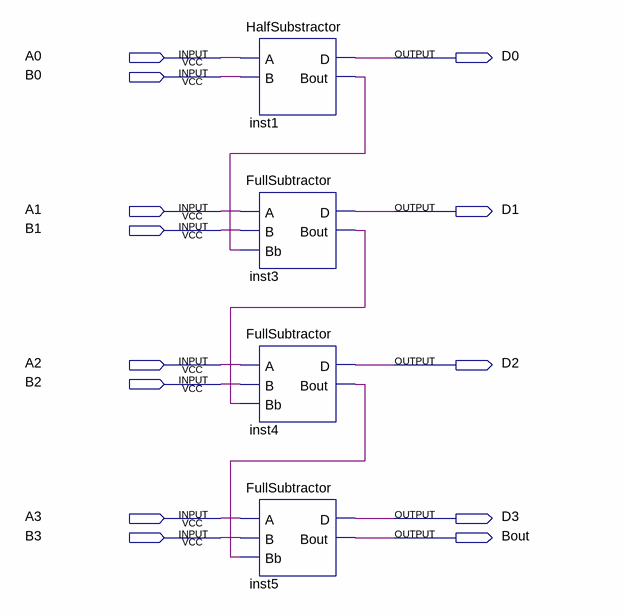
[diagram p0: schematic sheet]
// Quartus schematic 4BitFullSubstractor.bdf as structural Verilog: 4 symbols, 13 pins
module \4BitFullSubstractor  (
  input  A0,
  input  B0,
  input  A1,
  input  B1,
  input  A2,
  input  B2,
  input  A3,
  input  B3,
  output D0,
  output D1,
  output D2,
  output D3,
  output Bout
);

  wire inst1_bout, inst3_bout, inst4_bout;

  HalfSubstractor inst1 (.A(A0), .B(B0), .D(D0), .Bout(inst1_bout));
  FullSubtractor inst3 (.A(A1), .B(B1), .Bb(inst1_bout), .D(D1), .Bout(inst3_bout));
  FullSubtractor inst4 (.A(A2), .B(B2), .Bb(inst3_bout), .D(D2), .Bout(inst4_bout));
  FullSubtractor inst5 (.A(A3), .B(B3), .Bb(inst4_bout), .D(D3), .Bout(Bout));
endmodule
